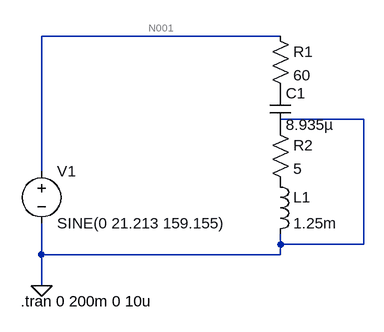
[diagram p0: schematic Схема3.asc]
Схема3.asc, the LTspice schematic file:
Version 4
SHEET 1 880 680
WIRE -1024 16 -1392 16
WIRE -896 144 -1024 144
WIRE -1392 224 -1392 16
WIRE -1024 336 -1024 320
WIRE -896 336 -896 144
WIRE -896 336 -1024 336
WIRE -1392 352 -1392 304
WIRE -1024 352 -1024 336
WIRE -1024 352 -1392 352
WIRE -1392 400 -1392 352
FLAG -1392 400 0
SYMBOL voltage -1392 208 R0
WINDOW 123 0 0 Left 0
WINDOW 39 0 0 Left 0
SYMATTR InstName V1
SYMATTR Value SINE(0 21.213 159.155)
SYMBOL res -1040 0 R0
SYMATTR InstName R1
SYMATTR Value 60
SYMBOL cap -1040 96 R0
SYMATTR InstName C1
SYMATTR Value 8.935µ
SYMBOL res -1040 144 R0
SYMATTR InstName R2
SYMATTR Value 5
SYMBOL ind -1040 224 R0
SYMATTR InstName L1
SYMATTR Value 1.25m
TEXT -1424 424 Left 2 !.tran 0 200m 0 10u

The netlist it stands for:
* Схема3.asc
V1 N001 0 SINE(0 21.213 159.155)
R1 N001 P001 60
C1 P001 P002 8.935µ
R2 P002 P003 5
L1 P003 0 1.25m
.tran 0 200m 0 10u
.backanno
.end

* Results of the author's LTspice run, read from the files saved beside the schematic
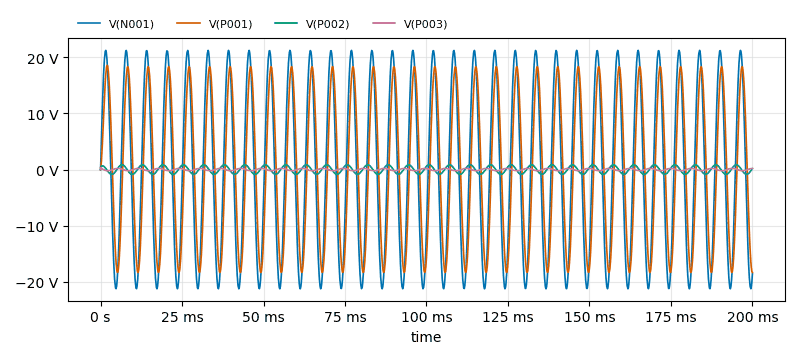
[diagram p1: Transient Analysis of Схема3.asc, plotted from the saved traces]
* Transient Analysis, 1 run:
*   V(N001): min -21.21 V, max 21.21 V, average 54.59 mV, rms 15 V, last -18.52 V
*   V(P001): min -18.31 V, max 18.54 V, average 104.1 mV, rms 12.94 V, last -18.31 V
*   V(P002): min -852 mV, max 852 mV, average -4.145 mV, rms 601.5 mV, last 188.3 mV
*   V(P003): min -206.6 mV, max 372.7 mV, average -20.46 µV, rms 146.4 mV, last 206.5 mV